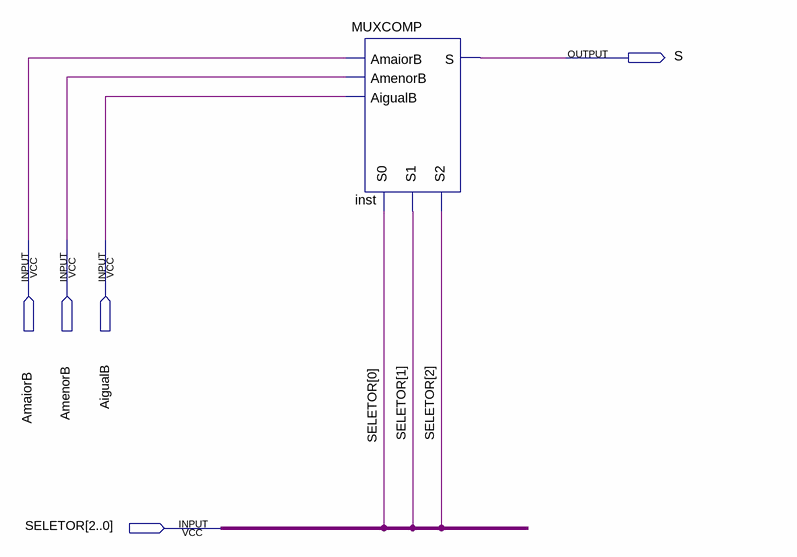
[diagram p0: schematic sheet]
// Quartus schematic MUXCOMP2.bdf as structural Verilog: 1 symbols, 5 pins
module MUXCOMP2 (
  input  AmaiorB,
  input  AmenorB,
  input  AigualB,
  input  [2:0] SELETOR,
  output S
);

  MUXCOMP inst (
    .AmaiorB(AmaiorB), .AmenorB(AmenorB), .AigualB(AigualB), .S2(SELETOR[2]), .S1(SELETOR[1]),
    .S0(SELETOR[0]), .S(S));
endmodule
